# Altium schematic sheet Filtrado y amplificación.SchDoc
size A4; SheetNumber: 4
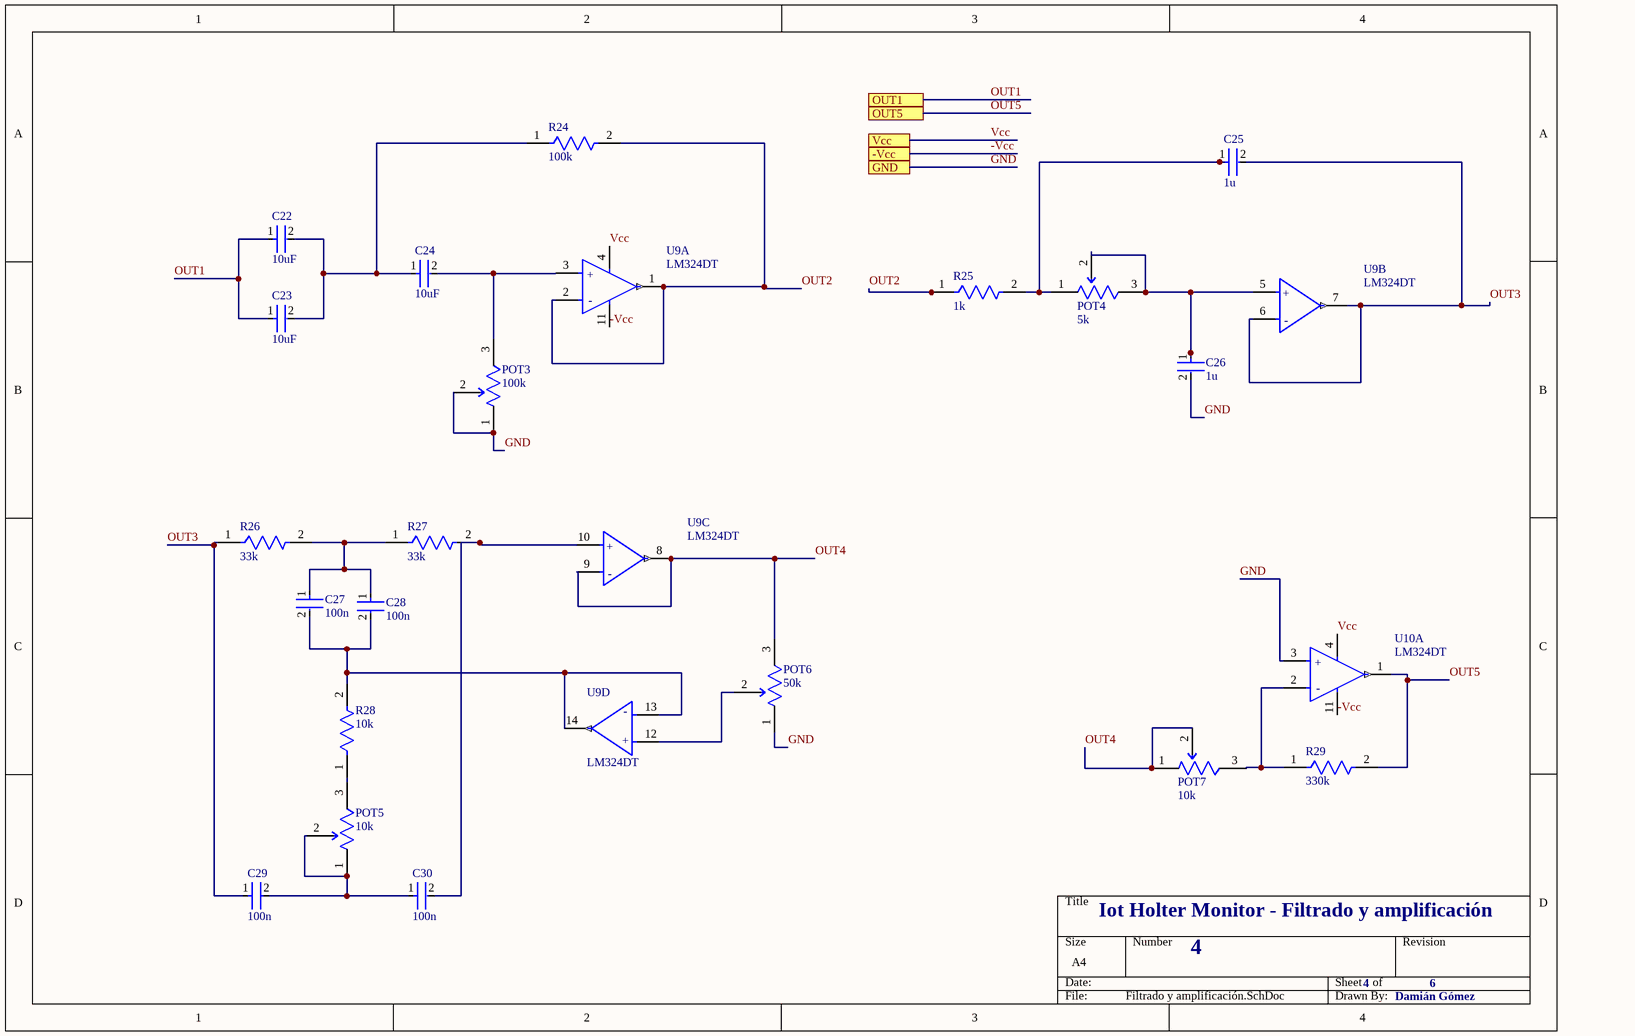
[diagram p0: Filtrado y amplificación.SchDoc]

## Parts
C22  10uF  [FP-CL31-IPC_C]
C23  10uF  [FP-CL31-IPC_C]
C24  10uF  [FP-CL31-IPC_C]
C25  1u  [FP-CL31-IPC_C]
C26  1u  [FP-CL31-IPC_C]
C27  100n  [FP-CL31-IPC_C]
C28  100n  [FP-CL31-IPC_C]
C29  100n  [FP-CL31-IPC_C]
C30  100n  [FP-CL31-IPC_C]
POT3  100k  [FP-3296W-MFG]
POT4  5k  [FP-3296W-MFG]
POT5  10k  [FP-3296W-MFG]
POT6  50k  [FP-3296W-MFG]
POT7  10k  [FP-3296W-MFG]
R24  100k  [FP-RC3216-MFG]
R25  1k  [FP-RC3216-MFG]
R26  33k  [FP-RC3216-MFG]
R27  33k  [FP-RC3216-MFG]
R28  10k  [FP-RC3216-MFG]
R29  330k  [FP-RC3216-MFG]
U9  LM324DT  [FP-SO-14-MFG]  (parts A,B,C,D of 4)
U10  LM324DT  [FP-SO-14-MFG]  (part A of 4)

## Ports
-Vcc, GND, OUT1, OUT5, Vcc

## Nets
-Vcc: U9.11(VCC-) U10.11(VCC-) ; port -Vcc
GND: C26.2 POT3.1(CCW) POT3.2(WIPER) POT6.1(CCW) U10.3(Non-Inverting_Input_1) ; port GND
OUT1: C22.1 C23.1 ; port OUT1
OUT2: R24.2 R25.1 U9.1(Output_1) U9.2(Inverting_Input_1)
OUT3: C25.2 C29.1 R26.1 U9.6(Inverting_Input_2) U9.7(Output_2)
OUT4: POT6.3(CW) POT7.1(CCW) POT7.2(WIPER) U9.8(Output_3) U9.9(Inverting_Input_3)
OUT5: R29.2 U10.1(Output_1) ; port OUT5
Vcc: U9.4(VCC+) U10.4(VCC+) ; port Vcc
NetC22_2: C22.2 C23.2 C24.1 R24.1
NetC24_2: C24.2 POT3.3(CW) U9.3(Non-Inverting_Input_1)
NetC25_1: C25.1 POT4.1(CCW) R25.2
NetC26_1: C26.1 POT4.2(WIPER) POT4.3(CW) U9.5(Non-Inverting_Input_2)
NetC27_1: C27.1 C28.1 R26.2 R27.1
NetC27_2: C27.2 C28.2 R28.2 U9.13(Inverting_Input_4) U9.14(Output_4)
NetC29_2: C29.2 C30.1 POT5.1(CCW) POT5.2(WIPER)
NetC30_2: C30.2 R27.2 U9.10(Non-Inverting_Input_3)
NetPOT5_3: POT5.3(CW) R28.1
NetPOT6_2: POT6.2(WIPER) U9.12(Non-Inverting_Input_4)
NetPOT7_3: POT7.3(CW) R29.1 U10.2(Inverting_Input_1)

## Notes on the sheet
- Iot Holter Monitor - Filtrado y amplificación
- 4
- 6
- Damián Gómez
- (in symbol CMP-12131-000005-1, part A) +; -
- (in symbol CMP-12131-000005-1, part B) +; -
- (in symbol CMP-12131-000005-1, part C) +; -
- (in symbol CMP-12131-000005-1, part D) -; +

## Library data of the parts
C22-C24 = CMP-13271-001211-1: Cap Ceramic 10uF 500V C0G ±5% SMD 1206 +125°C Embossed T/R; Capacitance: 220pF; Tolerance: 5%; Voltage Rating (DC): 500V; Depth: 1.6mm; Max Operating Temperature: 125°C; Width: 0.063inch; Radiation Hardening: No; Thickness: 0.055inch; Packaging: Tape and Reel; Height: 1.25mm; Case/Package: 1206; Package Quantity: 10000; Dielectric: C0G; Mount: Surface Mount; Voltage Rating: 500V; Min Operating Temperature: -55°C; Length: 3.2mm
C25 C26 = CMP-13271-001211-1: Cap Ceramic 1uF 500V C0G ±5% SMD 1206 +125°C Embossed T/R; Capacitance: 220pF; Tolerance: 5%; Voltage Rating (DC): 500V; Depth: 1.6mm; Max Operating Temperature: 125°C; Width: 0.063inch; Radiation Hardening: No; Thickness: 0.055inch; Packaging: Tape and Reel; Height: 1.25mm; Case/Package: 1206; Package Quantity: 10000; Dielectric: C0G; Mount: Surface Mount; Voltage Rating: 500V; Min Operating Temperature: -55°C; Length: 3.2mm
C27-C30 = CMP-13271-001211-1: Cap Ceramic 100nF 500V C0G ±5% SMD 1206 +125°C Embossed T/R; Capacitance: 220pF; Tolerance: 5%; Voltage Rating (DC): 500V; Depth: 1.6mm; Max Operating Temperature: 125°C; Width: 0.063inch; Radiation Hardening: No; Thickness: 0.055inch; Packaging: Tape and Reel; Height: 1.25mm; Case/Package: 1206; Package Quantity: 10000; Dielectric: C0G; Mount: Surface Mount; Voltage Rating: 500V; Min Operating Temperature: -55°C; Length: 3.2mm
POT3 = CMP-07234-000024-1: TRIMMER 100K OHM 0.5W PC PIN TOP; Resistance: 10kR; Temperature Coefficient: 100ppm/°C; Power Rating: 500mW; Tolerance: 10%; Number of Turns: 25; Width: 0.19inch; Termination: Pin; Radiation Hardening: No; Contact Plating: Tin; Composition: Cermet; Length: 9.53mm; Height: 0.395inch; Depth: 4.83mm; REACH SVHC: No SVHC; Weight: 0.03oz; Min Operating Temperature: -55°C; Military Standard: Not; Max Operating Temperature: 125°C; Packaging: Tape and Reel; Package Quantity: 1; Taper: Linear; Max Power Dissipation: 500mW; Mount: Through Hole
POT4 = CMP-07234-000024-1: TRIMMER 5K OHM 0.5W PC PIN TOP; Resistance: 10kR; Temperature Coefficient: 100ppm/°C; Power Rating: 500mW; Tolerance: 10%; Number of Turns: 25; Width: 0.19inch; Termination: Pin; Radiation Hardening: No; Contact Plating: Tin; Composition: Cermet; Length: 9.53mm; Height: 0.395inch; Depth: 4.83mm; REACH SVHC: No SVHC; Weight: 0.03oz; Min Operating Temperature: -55°C; Military Standard: Not; Max Operating Temperature: 125°C; Packaging: Tape and Reel; Package Quantity: 1; Taper: Linear; Max Power Dissipation: 500mW; Mount: Through Hole
POT5 POT7 = CMP-07234-000024-1: TRIMMER 10K OHM 0.5W PC PIN TOP; Resistance: 10kR; Temperature Coefficient: 100ppm/°C; Power Rating: 500mW; Tolerance: 10%; Number of Turns: 25; Width: 0.19inch; Termination: Pin; Radiation Hardening: No; Contact Plating: Tin; Composition: Cermet; Length: 9.53mm; Height: 0.395inch; Depth: 4.83mm; REACH SVHC: No SVHC; Weight: 0.03oz; Min Operating Temperature: -55°C; Military Standard: Not; Max Operating Temperature: 125°C; Packaging: Tape and Reel; Package Quantity: 1; Taper: Linear; Max Power Dissipation: 500mW; Mount: Through Hole
POT6 = CMP-07234-000024-1: TRIMMER 50K OHM 0.5W PC PIN TOP; Resistance: 10kR; Temperature Coefficient: 100ppm/°C; Power Rating: 500mW; Tolerance: 10%; Number of Turns: 25; Width: 0.19inch; Termination: Pin; Radiation Hardening: No; Contact Plating: Tin; Composition: Cermet; Length: 9.53mm; Height: 0.395inch; Depth: 4.83mm; REACH SVHC: No SVHC; Weight: 0.03oz; Min Operating Temperature: -55°C; Military Standard: Not; Max Operating Temperature: 125°C; Packaging: Tape and Reel; Package Quantity: 1; Taper: Linear; Max Power Dissipation: 500mW; Mount: Through Hole
R24 R25 = CMP-13261-001932-1: Res Thick Film 1206 1kΩ 5% 0.25W ±100ppm/°C Molded SMD T/R; Max Power Dissipation: 250mW; Resistance: 1kR; Voltage Rating (DC): 200V; Width: 0.063inch; Length: 0.126inch; Min Operating Temperature: -55°C; Packaging: Tape and Reel; Case Code (Metric): 3216; Contact Plating: Tin; Composition: Thick Film; Military Standard: Not; Depth: 1.6mm; Lead Free: Lead Free; Height: 0.026inch; Case Code (Imperial): 1206; Number of Terminations: 2; Radiation Hardening: No; Case/Package: 1206; Features: Moisture Resistant; Power Rating: 250mW; Max Operating Temperature: 155°C; Tolerance: 5%; Temperature Coefficient: 100ppm/°C
R26 R27 = CMP-13261-001932-1: Res Thick Film 1206 33kΩ 5% 0.25W ±100ppm/°C Molded SMD T/R; Max Power Dissipation: 250mW; Resistance: 1kR; Voltage Rating (DC): 200V; Width: 0.063inch; Length: 0.126inch; Min Operating Temperature: -55°C; Packaging: Tape and Reel; Case Code (Metric): 3216; Contact Plating: Tin; Composition: Thick Film; Military Standard: Not; Depth: 1.6mm; Lead Free: Lead Free; Height: 0.026inch; Case Code (Imperial): 1206; Number of Terminations: 2; Radiation Hardening: No; Case/Package: 1206; Features: Moisture Resistant; Power Rating: 250mW; Max Operating Temperature: 155°C; Tolerance: 5%; Temperature Coefficient: 100ppm/°C
R28 = CMP-13261-001932-1: Res Thick Film 1206 10kΩ 5% 0.25W ±100ppm/°C Molded SMD T/R; Max Power Dissipation: 250mW; Resistance: 1kR; Voltage Rating (DC): 200V; Width: 0.063inch; Length: 0.126inch; Min Operating Temperature: -55°C; Packaging: Tape and Reel; Case Code (Metric): 3216; Contact Plating: Tin; Composition: Thick Film; Military Standard: Not; Depth: 1.6mm; Lead Free: Lead Free; Height: 0.026inch; Case Code (Imperial): 1206; Number of Terminations: 2; Radiation Hardening: No; Case/Package: 1206; Features: Moisture Resistant; Power Rating: 250mW; Max Operating Temperature: 155°C; Tolerance: 5%; Temperature Coefficient: 100ppm/°C
R29 = CMP-13261-001932-1: Res Thick Film 1206 330kΩ 5% 0.25W ±100ppm/°C Molded SMD T/R; Max Power Dissipation: 250mW; Resistance: 1kR; Voltage Rating (DC): 200V; Width: 0.063inch; Length: 0.126inch; Min Operating Temperature: -55°C; Packaging: Tape and Reel; Case Code (Metric): 3216; Contact Plating: Tin; Composition: Thick Film; Military Standard: Not; Depth: 1.6mm; Lead Free: Lead Free; Height: 0.026inch; Case Code (Imperial): 1206; Number of Terminations: 2; Radiation Hardening: No; Case/Package: 1206; Features: Moisture Resistant; Power Rating: 250mW; Max Operating Temperature: 155°C; Tolerance: 5%; Temperature Coefficient: 100ppm/°C
U9 U10 = CMP-12131-000005-1: IC OPAMP GP 4 CIRCUIT 14SO; Manufacturer: STMicroelectronics; Voltage Gain: 100dB; Standoff Height: 0.1mm; Bandwidth: 1.3MHz; Max Junction Temp: +150°C; Min Supply Voltage: 3V; Max Dual Supply Voltage: 15V; Min Dual Supply Voltage: 1.5V; Number Of Channels: 4; Nominal Supply Current: 0.7-1.5mA; Output Current Per Channel: 20-50mA; Max Supply Voltage: 30V; Input Offset Voltage: 2mV; Input Bias Current: 0.02uA; Device Class L1: Integrated Circuits (ICs); Device Class L3: Amplifiers - Op Amps; Temperature Range Low: 0°C; Package: SO-14; Temperature Range High: +70°C; Digikey Description: IC OPAMP GP 4 CIRCUIT 14SO; Device Class L2: Linear ICs; Footprint Url: https://www.st.com/content/ccc/resource/technical/document/datasheet/group3/10/8a/e6/12/f8/e8/49/ce/DM00366438/files/DM00366438.pdf/jcr:content/translations/en.DM00366438.pdf; Octopart: https://octopart.com/lm324dt-stmicroelectronics-39579146; ComponentLink2URL: https://www.st.com/content/ccc/resource/technical/document/datasheet/bd/fc/46/43/26/8f/40/7f/CD00001046.pdf/files/CD00001046.pdf/jcr:content/translations/en.CD00001046.pdf; ComponentLink2Description: Datasheet; Lead Free: Yes; Temperature: 0°C to +70°C; RoHS: TRUE; Gain Bandwidth: 1.3MHz; Manufacturer Part Number: LM324DT; Automotive: No; Category: IC; Height: 1.75mm; Mouser Description: LM324 Series 32 V 1.3 MHz Low Power Quad Operational Amplifier - SOIC-14